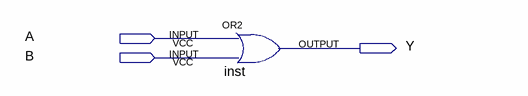
[diagram p0: schematic sheet]
// Quartus schematic exercise.bdf as structural Verilog: 1 symbols, 3 pins
module exercise (
  input  A,
  input  B,
  output Y
);

  or inst (Y, A, B);
endmodule
